# Altium schematic sheet power.SchDoc
size Letter; DrawnBy: Robson Souza; SheetNumber: 6; SheetTotal: 9
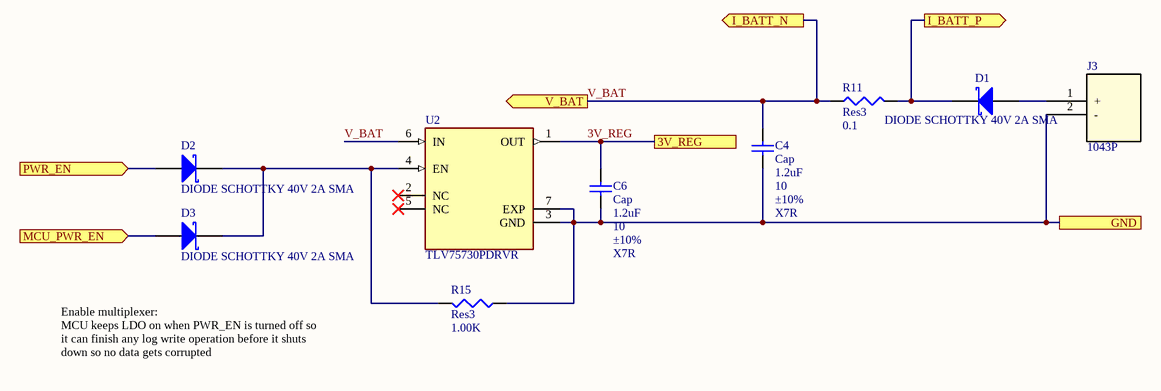
[diagram p0: power.SchDoc]

## Parts
C4  Cap  value 1.2uF  WV: 10  Tolerance: ±10%  Type: X7R  [CAPC2012X09M]
C6  Cap  value 1.2uF  WV: 10  Tolerance: ±10%  Type: X7R  [CAPC2012X09M]
D1  DIODE SCHOTTKY 40V 2A SMA  [DIOM4326X23M]
D2  DIODE SCHOTTKY 40V 2A SMA  [DIOM4326X23M]
D3  DIODE SCHOTTKY 40V 2A SMA  [DIOM4326X23M]
J3  1043P  [CONN2_1043P_KEY]
R11  Res3  value 0.1  [RESC2112X05M]
R15  Res3  value 1.00K  [RESC2112X05M]
U2  TLV75730PDRVR  [VREG_TLV75730PDRVR]

## Ports
3V_REG, GND, I_BATT_N (out), I_BATT_P (out), MCU_PWR_EN (in), PWR_EN (in), V_BAT (out)

## Nets
3V_REG: C6.2 U2.1(OUT) ; port 3V_REG
GND: C4.1 C6.1 J3.2(-) R15.1 U2.3(GND) U2.7(EXP) ; port GND
I_BATT_P: D1.1(K) R11.2 ; port I_BATT_P
MCU_PWR_EN: D3.2(A) ; port MCU_PWR_EN
PWR_EN: D2.2(A) ; port PWR_EN
V_BAT: C4.2 R11.1 U2.6(IN) ; port V_BAT, port I_BATT_N
NetD1_2: D1.2(A) J3.1(+)
NetD2_1: D2.1(K) D3.1(K) R15.2 U2.4(EN)

Not connected (* = marked no-connect by the designer): U2 2(NC)* 5(NC)*

## Notes on the sheet
- Enable multiplexer:
  MCU keeps LDO on when PWR_EN is turned off so it can finish any log write operation before it shuts down so no data gets corrupted

## Library data of the parts
C4 C6 = CAP-X7R-1.2uF-10V-±10%: CAP CER 1.2uF 10v X7R 0805; MPN: C0805C125K8RACTU; PN: 399-4928-1-ND; Name: CAP-X7R-1.2uF-10V-±10%; URL: http://www.digikey.ca/product-detail/en/C0805C125K8RACTU/399-4928-1-ND
D1-D3 = DIODE SCHOTTKY 40V 2A SMA: Schottky Rectifier; MPN: B240A-13-F; PN: B240A-FDICT-ND; URL: http://www.digikey.ca/product-detail/en/B240A-13-F/B240A-FDICT-ND
J3 = 1043P: No Description Available; Mfr_Name: Keystone Electronics; Copyright: Copyright (C) 2022 Ultra Librarian. All rights reserved.; Manufacturer_Part_Number: 1043P; Digi-Key_Part_Number_1: 36-1043P-ND; RefDes: RefDes; Type: DEV
R11 = Resistor_0R_Jumper: RES SMD 0.1 OHM 5% 1/8W 0805; MPN: CRCW08050000Z0EA; PN: 541-0.0ACT-ND; Name: Resistor_0R_Jumper; URL: http://www.digikey.ca/product-detail/en/CRCW08050000Z0EA/541-0.0ACT-ND
R15 = Resistor_1.00K: RES SMD 1.00K OHM 1% 1/8W 0805; MPN: CRCW08051K00FKEA; PN: 541-1.00KCCT-ND; Name: Resistor_1.00K; URL: http://www.digikey.ca/product-detail/en/CRCW08051K00FKEA/541-1.00KCCT-ND
U2 = TLV75730PDRVR: 1-A, low-IQ, high-accuracy, low-dropout voltage regulator with enable; MF: Texas Instruments; Digi-Key_Part_Number: 296-50008-2-ND; Purchase-URL: https://pricing.snapeda.com/search/part/TLV75730PDRVR/?ref=eda; SnapEDA_Link: https://www.snapeda.com/parts/TLV75730PDRVR/Texas+Instruments/view-part/?ref=snap; Value: *; MP: TLV75730PDRVR; Package: WSON-6 Texas Instruments; Check_prices: https://www.snapeda.com/parts/TLV75730PDRVR/Texas+Instruments/view-part/?ref=eda